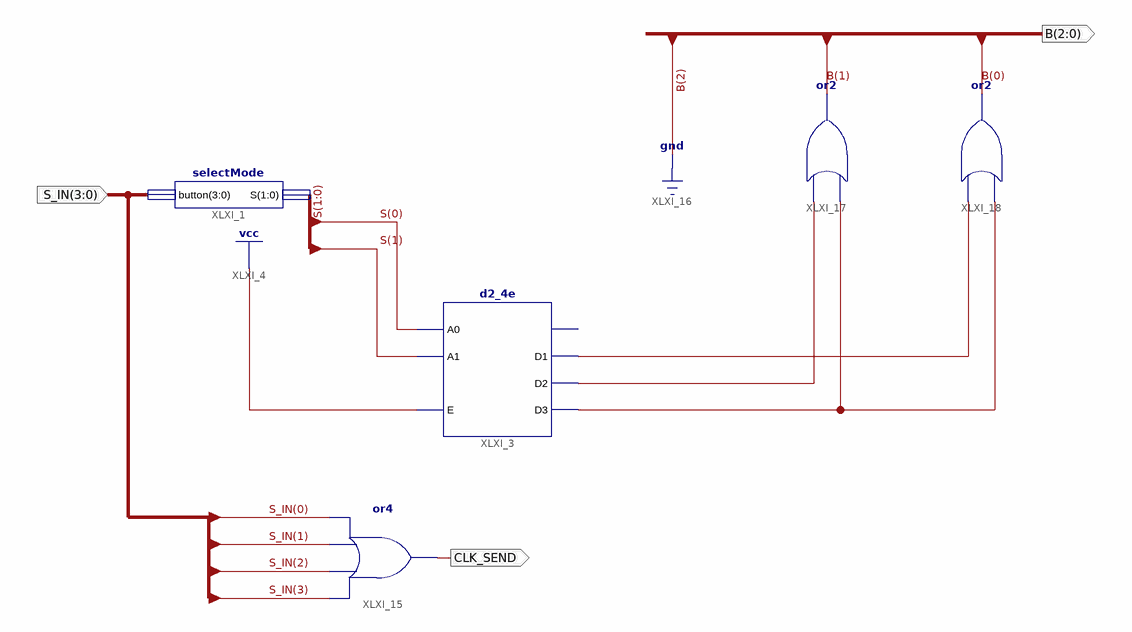
[diagram p0: schematic sheet 1]
// Xilinx ISE schematic Arduino_Controller.sch (spartan6) as structural Verilog: 5 symbols, 3 ports
module Arduino_Controller (
  input  [3:0] S_IN,
  output [2:0] B,
  output CLK_SEND
);

  wire XLXN_13, XLXN_31, XLXN_44;
  wire [1:0] S;

  selectMode XLXI_1 (.button(S_IN), .S(S));
  d2_4e XLXI_3 (.A0(S[0]), .A1(S[1]), .E(1'b1), .D1(XLXN_13), .D2(XLXN_31), .D3(XLXN_44));  // open: D0
  or XLXI_15 (CLK_SEND, S_IN[3], S_IN[2], S_IN[1], S_IN[0]);
  or XLXI_18 (B[0], XLXN_44, XLXN_13);
  or XLXI_17 (B[1], XLXN_44, XLXN_31);

  assign B[2] = 1'b0;
endmodule
